# Altium schematic sheet gpio.SchDoc: GPIO
size A4; Organization: Badgerloop; Address1: 133 Engineering Research; Address2: Building; Address3: Madison, WI 53715; SheetNumber: 18
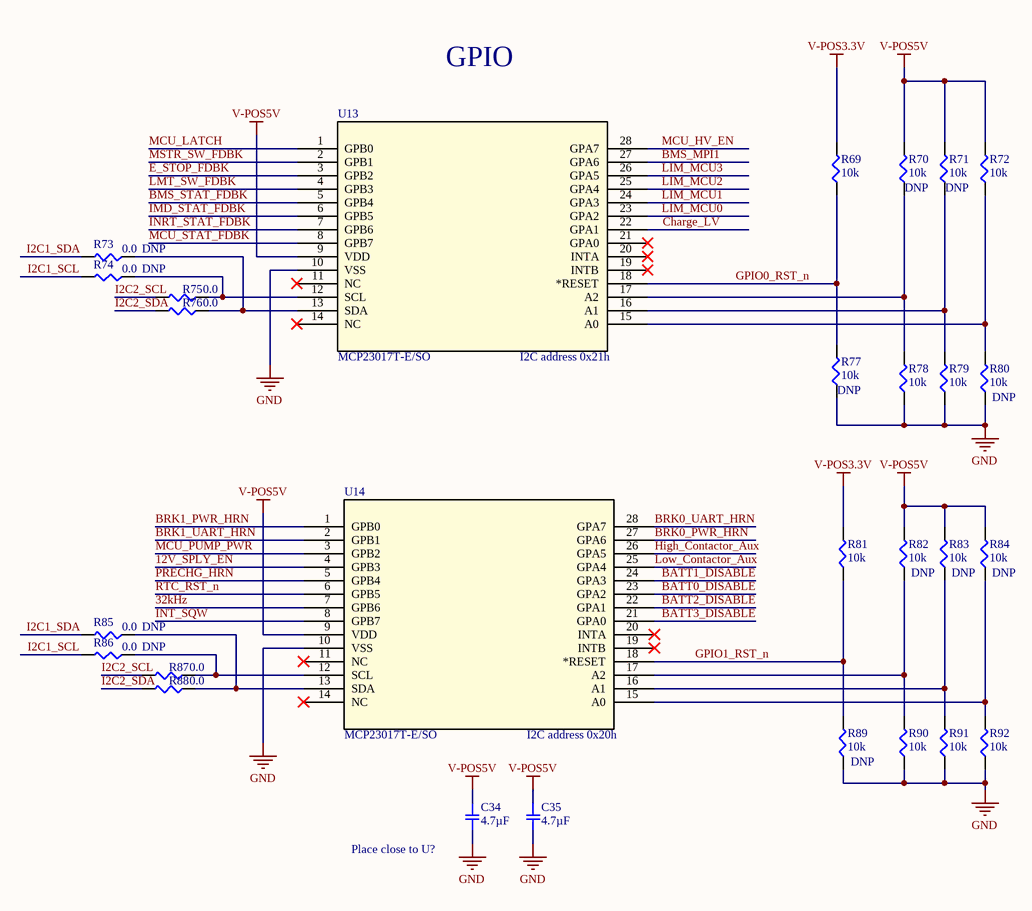
[diagram p0: gpio.SchDoc]

## Parts
C34  4.7µF  [SMD-0805C]
C35  4.7µF  [SMD-0805C]
R69  10k  [SMD-0805-RES]
R70  10k  [SMD-0805-RES]
R71  10k  [SMD-0805-RES]
R72  10k  [SMD-0805-RES]
R73  0.0  [SMD-0805-RES]
R74  0.0  [SMD-0805-RES]
R75  0.0  [SMD-0805-RES]
R76  0.0  [SMD-0805-RES]
R77  10k  [SMD-0805-RES]
R78  10k  [SMD-0805-RES]
R79  10k  [SMD-0805-RES]
R80  10k  [SMD-0805-RES]
R81  10k  [SMD-0805-RES]
R82  10k  [SMD-0805-RES]
R83  10k  [SMD-0805-RES]
R84  10k  [SMD-0805-RES]
R85  0.0  [SMD-0805-RES]
R86  0.0  [SMD-0805-RES]
R87  0.0  [SMD-0805-RES]
R88  0.0  [SMD-0805-RES]
R89  10k  [SMD-0805-RES]
R90  10k  [SMD-0805-RES]
R91  10k  [SMD-0805-RES]
R92  10k  [SMD-0805-RES]
U13  MCP23017T-E/SO  [SOIC28-W_MC-M]
U14  MCP23017T-E/SO  [SOIC28-W_MC-M]

## Nets
GND: C34.2 C35.2 R77.1 R78.1 R79.1 R80.1 R89.1 R90.1 R91.1 R92.1 U13.10(VSS) U14.10(VSS)
V-POS3.3V: R69.2 R81.2
V-POS5V: C34.1 C35.1 R70.2 R71.2 R72.2 R82.2 R83.2 R84.2 U13.9(VDD) U14.9(VDD)
12V_SPLY_EN: U14.4(GPB3)
32kHz: U14.7(GPB6)
BATT0_DISABLE: U14.23(GPA2)
BATT1_DISABLE: U14.24(GPA3)
BATT2_DISABLE: U14.22(GPA1)
BATT3_DISABLE: U14.21(GPA0)
BMS_MPI1: U13.27(GPA6)
BMS_STAT_FDBK: U13.5(GPB4)
BRK0_PWR_HRN: U14.27(GPA6)
BRK0_UART_HRN: U14.28(GPA7)
BRK1_PWR_HRN: U14.1(GPB0)
BRK1_UART_HRN: U14.2(GPB1)
Charge_LV: U13.22(GPA1)
E_STOP_FDBK: U13.3(GPB2)
GPIO0_RST_n: R69.1 R77.2 U13.18(*RESET)
GPIO1_RST_n: R81.1 R89.2 U14.18(*RESET)
High_Contactor_Aux: U14.26(GPA5)
I2C1_SCL: R74.2 R86.2
I2C1_SDA: R73.2 R85.2
I2C2_SCL: R75.2 R87.2
I2C2_SDA: R76.2 R88.2
IMD_STAT_FDBK: U13.6(GPB5)
INRT_STAT_FDBK: U13.7(GPB6)
INT_SQW: U14.8(GPB7)
LIM_MCU0: U13.23(GPA2)
LIM_MCU1: U13.24(GPA3)
LIM_MCU2: U13.25(GPA4)
LIM_MCU3: U13.26(GPA5)
LMT_SW_FDBK: U13.4(GPB3)
Low_Contactor_Aux: U14.25(GPA4)
MCU_HV_EN: U13.28(GPA7)
MCU_LATCH: U13.1(GPB0)
MCU_PUMP_PWR: U14.3(GPB2)
MCU_STAT_FDBK: U13.8(GPB7)
MSTR_SW_FDBK: U13.2(GPB1)
PRECHG_HRN: U14.5(GPB4)
RTC_RST_n: U14.6(GPB5)
NetR70_1: R70.1 R78.2 U13.17(A2)
NetR71_1: R71.1 R79.2 U13.16(A1)
NetR72_1: R72.1 R80.2 U13.15(A0)
NetR73_1: R73.1 R76.1 U13.13(SDA)
NetR74_1: R74.1 R75.1 U13.12(SCL)
NetR82_1: R82.1 R90.2 U14.17(A2)
NetR83_1: R83.1 R91.2 U14.16(A1)
NetR84_1: R84.1 R92.2 U14.15(A0)
NetR85_1: R85.1 R88.1 U14.13(SDA)
NetR86_1: R86.1 R87.1 U14.12(SCL)

Not connected (* = marked no-connect by the designer): U13 11(NC)* 14(NC)* 19(INTB)* 20(INTA)* 21(GPA0)*; U14 11(NC)* 14(NC)* 19(INTB)* 20(INTA)*

## Notes on the sheet
- GPIO
- (near U13) I2C address 0x21h
- (near U14) I2C address 0x20h
- (near C34) Place close to U?
- Title
- Size:
- Date:
- A4
- Number:
- Time:
- Revision:
- Sheet
- of
- File:

## Library data of the parts
C34 C35 = GRM21BR60J475KA11L: CAP CER 4.7UF 6.3V X5R 0805; Manufacturer: Murata Electronics North America; Factory Stock: 0; Unit Price (USD): 0.28; Minimum Quantity: 1; Tolerance: ±10%; Datasheets: http://www.murata.com/~/media/webrenewal/support/library/catalog/products/capacitor/mlcc/c02e.pdf; Image: //media.digikey.com/Renders/Murata%20Renders/0805%20(2012%20Metric)%20.85mm.jpg; Digi-Key Part Number: 490-9749-1-ND; Part Number: GRM21BR60J475KA11L; Quantity Available: 2821; @ qty: 0; Packaging: Cut Tape (CT); Series: GRM; Part Status: Active; Value: 4.7µF; Voltage: 6.3V; Temperature Coefficient: X5R; Operating Temperature: -55°C ~ 85°C; Features: -; Ratings: -; Applications: General Purpose; Mounting Type: Surface Mount, MLCC; Package / Case: 0805 (2012 Metric); Size / Dimension: 0.079" L x 0.049" W (2.00mm x 1.25mm); Height - Seated (Max): -; Thickness (Max): 0.055" (1.40mm); Lead Spacing: -; Lead Style: -
R69-R72 R77-R84 R89-R92 = ERJ-P06J103V: RES SMD 10K OHM 5% 1/2W 0805; Manufacturer: Panasonic Electronic Components; Factory Stock: 0; Unit Price (USD): 0.01839; @ qty: 1500; Minimum Quantity: 1; Power (Watts): 0.5W, 1/2W; Temperature Coefficient: ±200ppm/°C; Part Number: ERJ-P06J103V; Datasheets: https://industrial.panasonic.com/cdbs/www-data/pdf/RDA0000/AOA0000C243.pdf; Image: //media.digikey.com/Renders/Panasonic%20Renders/ERJ-0805%20Pkg.jpg; Digi-Key Part Number: P10KADCT-ND; Quantity Available: 413576; Packaging: Cut Tape (CT); Series: ERJ; Part Status: Active; Value: 10k; Tolerance: ±5%; Composition: Thick Film; Features: Automotive AEC-Q200, Pulse Withstanding; Operating Temperature: -55°C ~ 155°C; Package / Case: 0805 (2012 Metric); Supplier Device Package: 0805; Size / Dimension: 0.079" L x 0.049" W (2.00mm x 1.25mm); Height - Seated (Max): 0.028" (0.70mm); Number of Terminations: 2; Failure Rate: -
  R70 R71 R77 R80 R82-R84 R89: DNP: DNP
R73-R76 R85-R88 = ERJ-6GEY0R00V: RES SMD 0.0 OHM JUMPER 1/8W 0805; Manufacturer: Panasonic Electronic Components; Factory Stock: 0; Unit Price (USD): 0.00544; @ qty: 1500; Minimum Quantity: 1; Power (Watts): 0.125W, 1/8W; Part Number: ERJ-6GEY0R00V; Datasheets: http://industrial.panasonic.com/www-cgi/jvcr13pz.cgi?E+PZ+3+AOA0001+ERJ6GEY0R00V+7+WW; Image: //media.digikey.com/Renders/Panasonic%20Renders/ERJ-0805%20Pkg.jpg; Digi-Key Part Number: P0.0ACT-ND; Quantity Available: 1597627; Packaging: Cut Tape (CT); Series: ERJ; Part Status: Active; Value: 0.0; Tolerance: Jumper; Composition: Thick Film; Features: Automotive AEC-Q200; Temperature Coefficient: -; Operating Temperature: -55°C ~ 155°C; Package / Case: 0805 (2012 Metric); Supplier Device Package: 0805; Size / Dimension: 0.079" L x 0.049" W (2.00mm x 1.25mm); Height - Seated (Max): 0.028" (0.70mm); Number of Terminations: 2; Failure Rate: -
  R73 R74 R85 R86: DNP: DNP
U13 U14 = MCP23017T-E/SO: IC I/O EXPANDER I2C 16B 28SOIC; Manufacturer: Microchip; Manufacturer P/N: MCP23017T-E/SO; Digikey P/N: MCP23017T-E/SOCT-ND; Digikey Link: https://www.digikey.com/product-detail/en/microchip-technology/MCP23017T-E-SO/MCP23017T-E-SOCT-ND/5358289